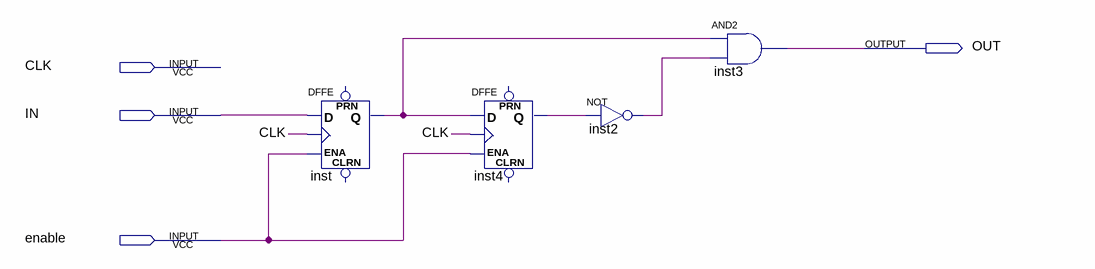
[diagram p0: schematic sheet]
// Quartus schematic RisingEdgeEnable.bdf as structural Verilog: 4 symbols, 4 pins
module RisingEdgeEnable (
  input  CLK,
  input  IN,
  input  enable,
  output OUT
);

  wire inst2_out, inst4_q, inst_q;

  DFFE inst (.D(IN), .CLK(CLK), .ENA(enable), .Q(inst_q));  // open: PRN, CLRN
  DFFE inst4 (.D(inst_q), .CLK(CLK), .ENA(enable), .Q(inst4_q));  // open: PRN, CLRN
  not inst2 (inst2_out, inst4_q);
  and inst3 (OUT, inst_q, inst2_out);
endmodule
